# EAGLE design R107B (EAGLE 6.6.0)
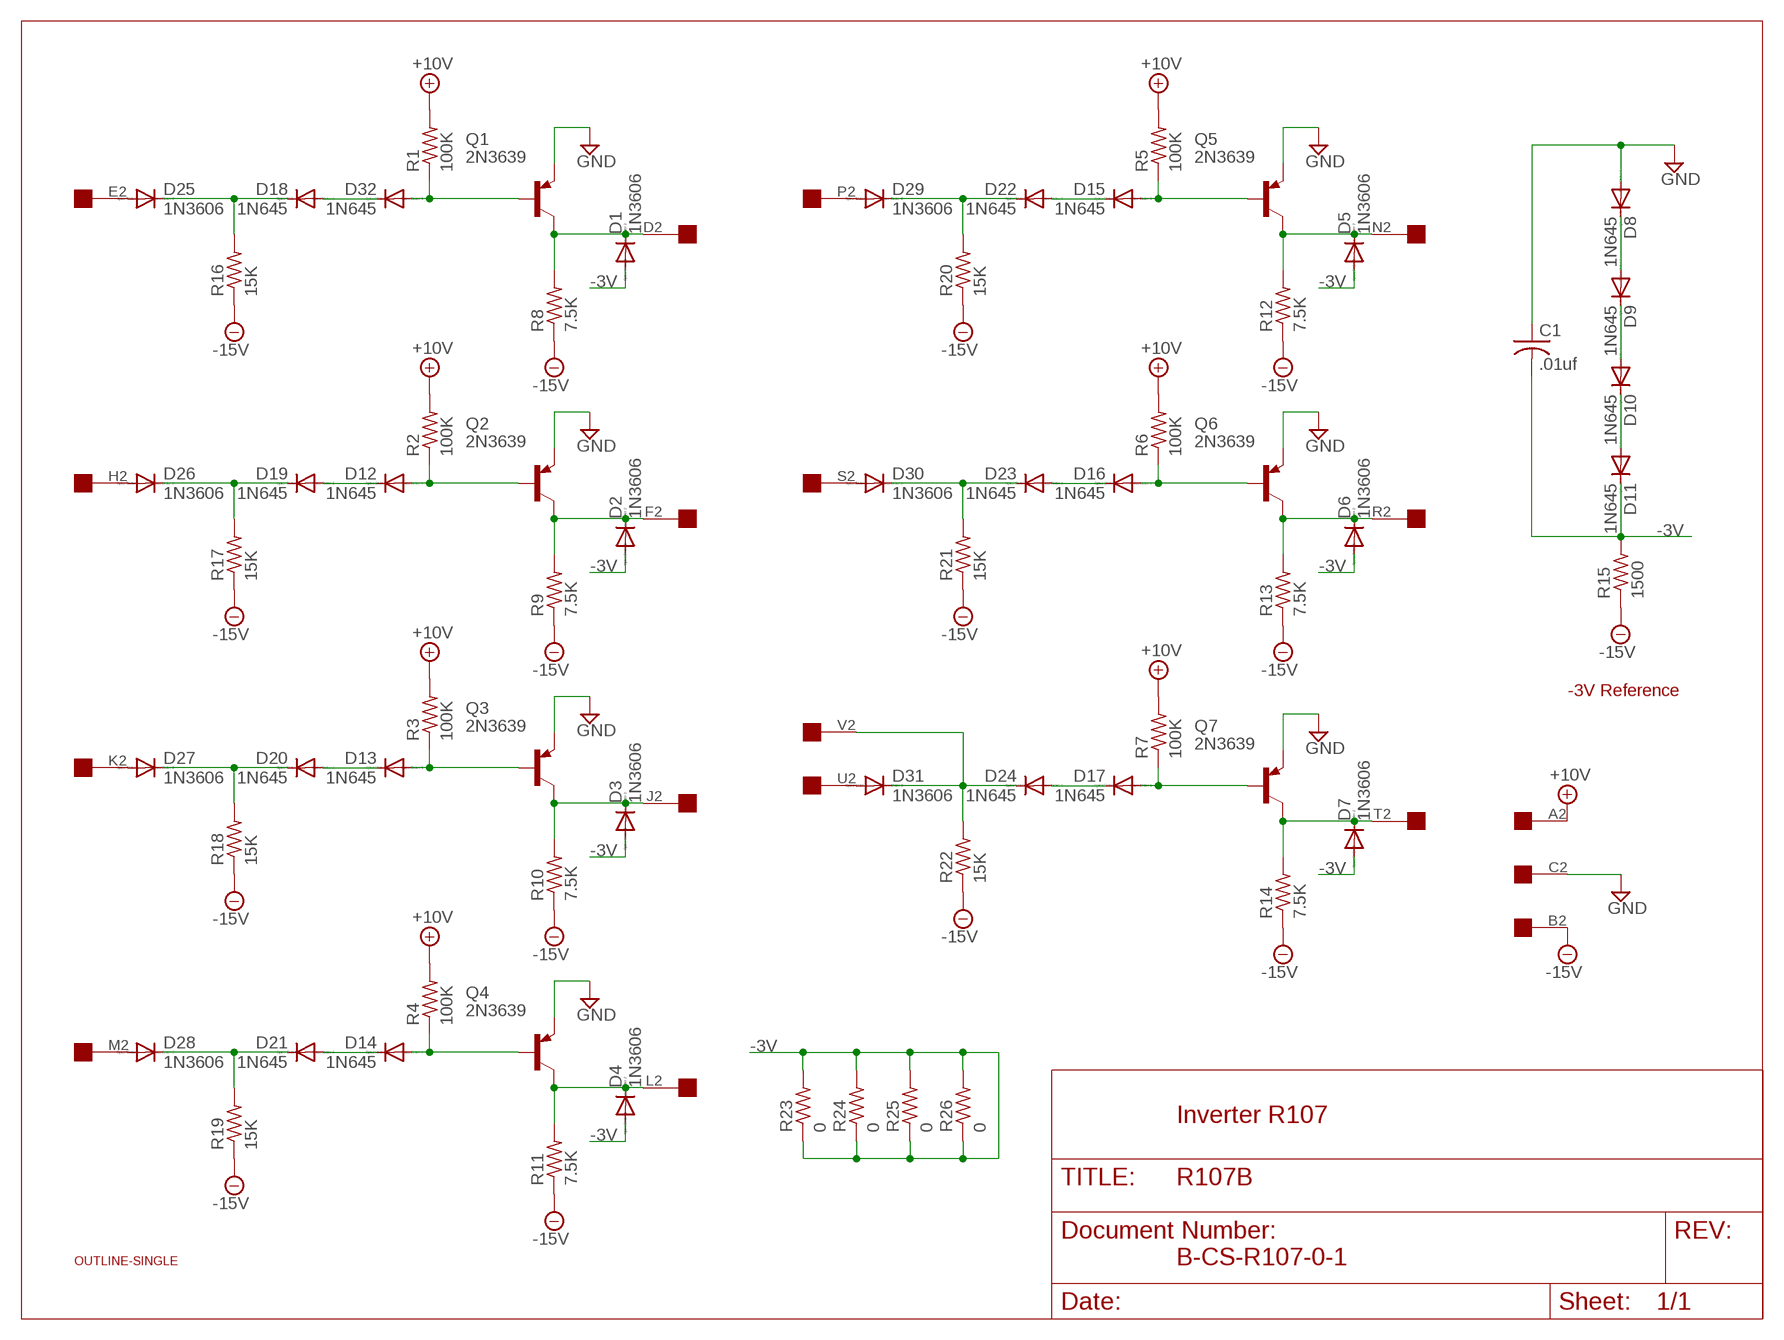
[diagram p0: schematic, sheet 1]

## Parts
C1  .01uf  C-US  [C063-025X075]
D1  1N3606  1N4148DO35-10  [DO35-10]
D2  1N3606  1N4148DO35-10  [DO35-10]
D3  1N3606  1N4148DO35-10  [DO35-10]
D4  1N3606  1N4148DO35-10  [DO35-10]
D5  1N3606  1N4148DO35-10  [DO35-10]
D6  1N3606  1N4148DO35-10  [DO35-10]
D7  1N3606  1N4148DO35-10  [DO35-10]
D8  1N645  1N4148DO35-10  [DO35-10]
D9  1N645  1N4148DO35-10  [DO35-10]
D10  1N645  1N4148DO35-10  [DO35-10]
D11  1N645  1N4148DO35-10  [DO35-10]
D12  1N645  1N4148DO35-10  [DO35-10]
D13  1N645  1N4148DO35-10  [DO35-10]
D14  1N645  1N4148DO35-10  [DO35-10]
D15  1N645  1N4148DO35-10  [DO35-10]
D16  1N645  1N4148DO35-10  [DO35-10]
D17  1N645  1N4148DO35-10  [DO35-10]
D18  1N645  1N4148DO35-10  [DO35-10]
D19  1N645  1N4148DO35-10  [DO35-10]
D20  1N645  1N4148DO35-10  [DO35-10]
D21  1N645  1N4148DO35-10  [DO35-10]
D22  1N645  1N4148DO35-10  [DO35-10]
D23  1N645  1N4148DO35-10  [DO35-10]
D24  1N645  1N4148DO35-10  [DO35-10]
D25  1N3606  1N4148DO35-10  [DO35-10]
D26  1N3606  1N4148DO35-10  [DO35-10]
D27  1N3606  1N4148DO35-10  [DO35-10]
D28  1N3606  1N4148DO35-10  [DO35-10]
D29  1N3606  1N4148DO35-10  [DO35-10]
D30  1N3606  1N4148DO35-10  [DO35-10]
D31  1N3606  1N4148DO35-10  [DO35-10]
D32  1N645  1N4148DO35-10  [DO35-10]
Q1  2N3639  2N3637  [TO39]
Q2  2N3639  2N3637  [TO39]
Q3  2N3639  2N3637  [TO39]
Q4  2N3639  2N3637  [TO39]
Q5  2N3639  2N3637  [TO39]
Q6  2N3639  2N3637  [TO39]
Q7  2N3639  2N3637  [TO39]
R1  100K  R-US_0207/10  [0207/10]
R2  100K  R-US_0207/10  [0207/10]
R3  100K  R-US_0207/10  [0207/10]
R4  100K  R-US_0207/10  [0207/10]
R5  100K  R-US_0207/10  [0207/10]
R6  100K  R-US_0207/10  [0207/10]
R7  100K  R-US_0207/10  [0207/10]
R8  7.5K  R-US_0207/10  [0207/10]
R9  7.5K  R-US_0207/10  [0207/10]
R10  7.5K  R-US_0207/10  [0207/10]
R11  7.5K  R-US_0207/10  [0207/10]
R12  7.5K  R-US_0207/10  [0207/10]
R13  7.5K  R-US_0207/10  [0207/10]
R14  7.5K  R-US_0207/10  [0207/10]
R15  1500  R-US_0207/10  [0207/10]
R16  15K  R-US_0207/10  [0207/10]
R17  15K  R-US_0207/10  [0207/10]
R18  15K  R-US_0207/10  [0207/10]
R19  15K  R-US_0207/10  [0207/10]
R20  15K  R-US_0207/10  [0207/10]
R21  15K  R-US_0207/10  [0207/10]
R22  15K  R-US_0207/10  [0207/10]
R23  0  R-US_0207/10  [0207/10]
R24  0  R-US_0207/10  [0207/10]
R25  0  R-US_0207/10  [0207/10]
R26  0  R-US_0207/10  [0207/10]
U$1  OUTLINE-SINGLE  [SINGLE]
U$2  EDGE-1  [EDGE-CON1]

## Nets
+10V [Power]: R1.2 R2.2 R3.2 R4.2 R5.2 R6.2 R7.2 U$2.A2
-3V [Power]: C1.2 D1.A D2.A D3.A D4.A D5.A D6.A D7.A D11.C R15.2 R23.1 R23.2 R24.1 R24.2 R25.1 R25.2 R26.1 R26.2
-15V [Power]: R8.1 R9.1 R10.1 R11.1 R12.1 R13.1 R14.1 R15.1 R16.1 R17.1 R18.1 R19.1 R20.1 R21.1 R22.1 U$2.B2
GND [Power]: C1.1 D8.A Q1.1(E) Q2.1(E) Q3.1(E) Q4.1(E) Q5.1(E) Q6.1(E) Q7.1(E) U$2.C2
N$1: D7.C Q7.3(C) R14.2 U$2.T2
N$2: D12.A Q2.2(B) R2.1
N$3: D8.C D9.A
N$4: D2.C Q2.3(C) R9.2 U$2.F2
N$5: D26.A U$2.H2
N$6: D19.C D26.C R17.2
N$7: D12.C D19.A
N$8: D13.A Q3.2(B) R3.1
N$9: D3.C Q3.3(C) R10.2 U$2.J2
N$10: D27.A U$2.K2
N$11: D20.C D27.C R18.2
N$12: D13.C D20.A
N$13: D9.C D10.A
N$14: D31.A U$2.U2
N$15: D17.A Q7.2(B) R7.1
N$16: D10.C D11.A
N$17: D24.C D31.C R22.2 U$2.V2
N$18: D17.C D24.A
N$19: D32.A Q1.2(B) R1.1
N$20: D1.C Q1.3(C) R8.2 U$2.D2
N$21: D25.A U$2.E2
N$22: D18.C D25.C R16.2
N$23: D18.A D32.C
N$24: D14.A Q4.2(B) R4.1
N$25: D4.C Q4.3(C) R11.2 U$2.L2
N$26: D28.A U$2.M2
N$27: D21.C D28.C R19.2
N$28: D14.C D21.A
N$29: D15.A Q5.2(B) R5.1
N$30: D5.C Q5.3(C) R12.2 U$2.N2
N$31: D29.A U$2.P2
N$32: D22.C D29.C R20.2
N$33: D15.C D22.A
N$34: D16.A Q6.2(B) R6.1
N$35: D6.C Q6.3(C) R13.2 U$2.R2
N$36: D30.A U$2.S2
N$37: D23.C D30.C R21.2
N$38: D16.C D23.A

## Notes on the sheet
- -3V Reference
- Inverter R107
- B-CS-R107-0-1

## Library data of the parts
C1 = dec-con:C-US: Capacitors with funky DEC lead spacing.
D1-D32 = diode:1N4148: DIODE high speed (Philips)
Q1-Q7 = transistor-pnp:2N3637*: PNP Transistror
R1-R26 = rcl:R-US_: RESISTOR, American symbol
U$1 = dec-con:OUTLINE-*: Board outlines for DEC boards.
U$2 = dec-con:EDGE-1: Single-Sided DEC Edge Connector -- (side 2)

## Net classes
0 default: width 0.813 mm
1 Power: width 0.813 mm

## Board
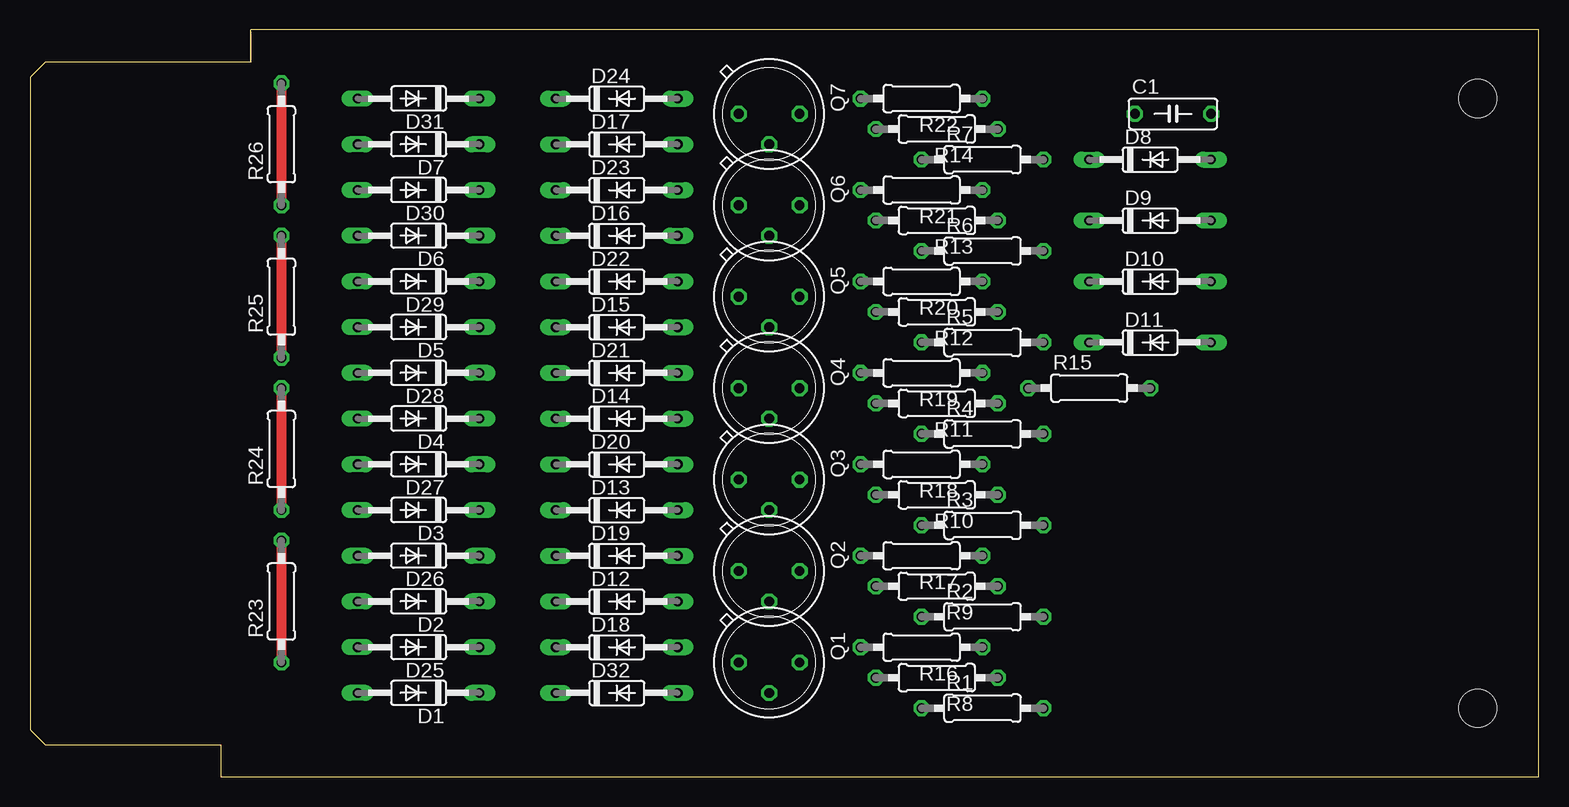
[diagram p1: board, top side]
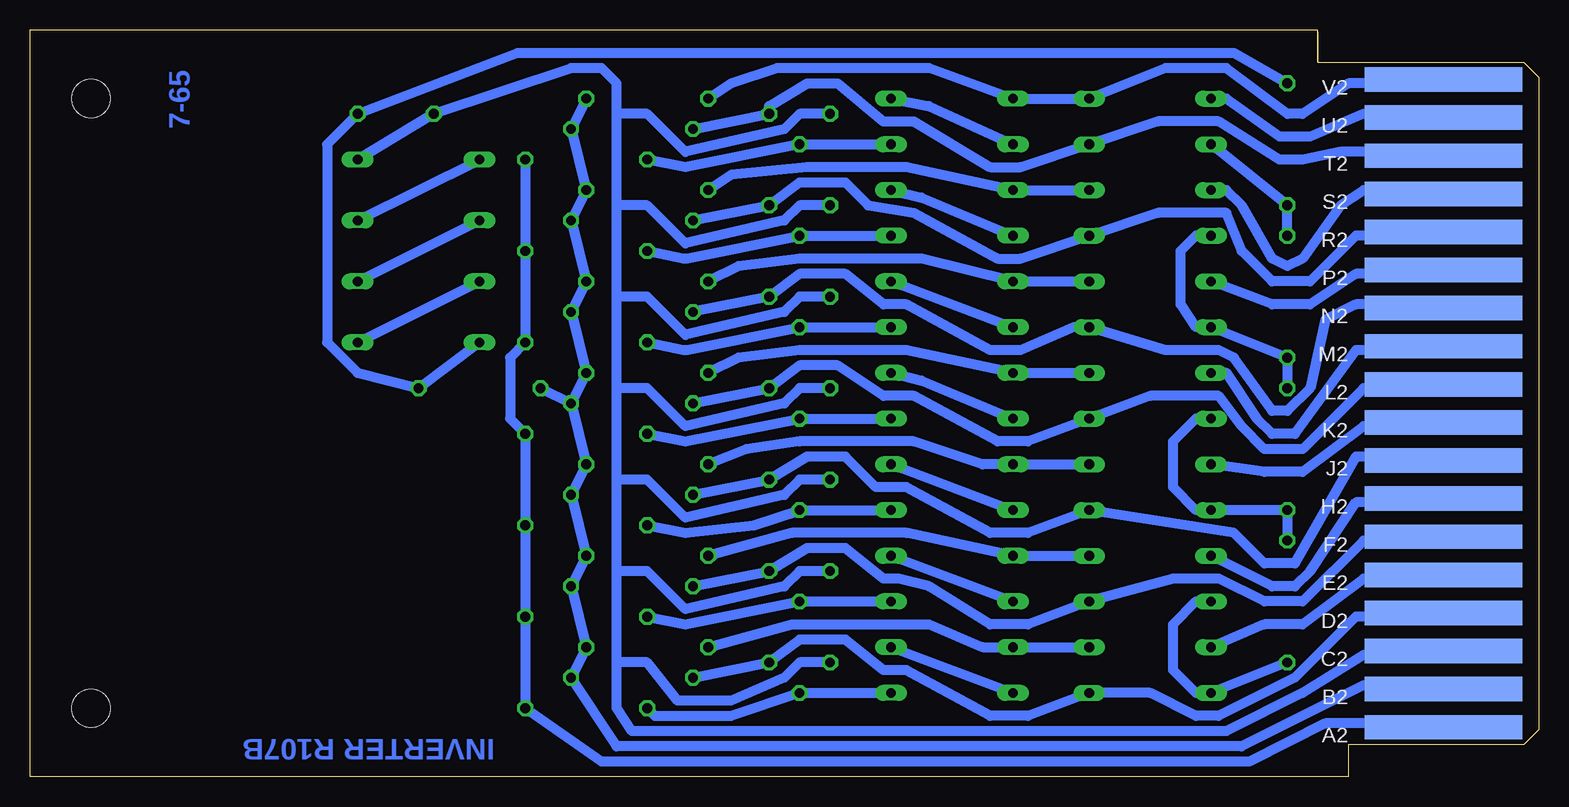
[diagram p2: board, bottom side, seen from below]

Size 125.73 x 62.23 mm. Coordinates in mm from the lower left corner, seen from the top.
Copper layers (1+16): Top 0.035mm / dielectric 1.5mm / Bottom 0.035mm
Design rules "16mils": minimum track width 16mil, minimum drill 32mil, track to track 15mil, track to pad 10mil, pad to pad 10mil, via to via 10mil, smd to smd 10mil, copper to edge 13mil, drill to drill 10mil, minimum pad ring 10mil, minimum via ring 8mil, stop-mask expansion 0mil, vias tented up to drill 0mil, thermal gap 10mil

### Footprints (pad centres in the part's own frame; a part is rotated, then mirrored left to right if it is on the bottom)
C063-025X075 = drill 0.813 octagon: 1 -2.54,0; 2 3.81,0
DO35-10 = drill 0.813 long: A 5.08,0; C -5.08,0
TO39 = drill 0.813 octagon: 1 0,-2.54; 2 2.54,0; 3 0,2.54
0207/10 = drill 0.813 octagon: 1 -5.08,0; 2 5.08,0
SINGLE = hole 3.175: 120.65,56.515; 120.65,5.715
EDGE-CON1 = smd 13.106 x 2.032 bottom: A2 7.938,4.128; B2 7.938,7.303; C2 7.938,10.477; D2 7.938,13.652; E2 7.938,16.828; F2 7.938,20.003; H2 7.938,23.177; J2 7.938,26.352; K2 7.938,29.527; L2 7.938,32.703; M2 7.938,35.877; N2 7.938,39.053; P2 7.938,42.227; R2 7.938,45.403; S2 7.938,48.578; T2 7.938,51.752; U2 7.938,54.928; V2 7.938,58.102

### Placement (x,y rotation side)
C1  94.62,55.24 0 top
D1  32.39,6.99 180 top
D2  32.39,14.61 180 top
D3  32.39,22.23 180 top
D4  32.39,29.84 180 top
D5  32.39,37.47 180 top
D6  32.39,45.09 180 top
D7  32.39,52.7 180 top
D8  93.35,51.44 0 top
D9  93.35,46.35 0 top
D10  93.35,41.27 0 top
D11  93.35,36.2 0 top
D12  48.9,14.61 0 top
D13  48.9,22.23 0 top
D14  48.9,29.84 0 top
D15  48.9,37.47 0 top
D16  48.9,45.09 0 top
D17  48.9,52.7 0 top
D18  48.9,10.79 0 top
D19  48.9,18.41 0 top
D20  48.9,26.04 0 top
D21  48.9,33.66 0 top
D22  48.9,41.27 0 top
D23  48.9,48.9 0 top
D24  48.9,56.52 0 top
D25  32.39,10.79 180 top
D26  32.39,18.41 180 top
D27  32.39,26.04 180 top
D28  32.39,33.66 180 top
D29  32.39,41.27 180 top
D30  32.39,48.9 180 top
D31  32.39,56.52 180 top
D32  48.9,6.99 0 top
Q1  61.6,9.53 270 top
Q2  61.6,17.14 270 top
Q3  61.6,24.77 270 top
Q4  61.6,32.38 270 top
Q5  61.6,40.01 270 top
Q6  61.6,47.62 270 top
Q7  61.6,55.24 270 top
R1  79.38,5.71 0 top
R2  79.38,13.34 0 top
R3  79.38,20.95 0 top
R4  79.38,28.57 0 top
R5  79.38,36.2 0 top
R6  79.38,43.81 0 top
R7  79.38,51.44 0 top
R8  75.57,8.26 180 top
R9  75.57,15.88 180 top
R10  75.57,23.5 180 top
R11  75.57,31.11 180 top
R12  75.57,38.73 180 top
R13  75.57,46.35 180 top
R14  75.57,53.98 180 top
R15  88.27,32.38 0 top
R16  74.3,10.79 180 top
R17  74.3,18.41 180 top
R18  74.3,26.04 180 top
R19  74.3,33.66 180 top
R20  74.3,41.27 180 top
R21  74.3,48.9 180 top
R22  74.3,56.52 180 top
R23  20.96,14.61 90 top
R24  20.96,27.3 90 top
R25  20.96,40.01 90 top
R26  20.96,52.7 90 top
U$1  0,0 0 top
U$2  0,0 0 top

### Tracks (layer width: path | path; a pad name or v marks a point on that pad's centre or on a via)
+10V
  Bottom 0.813: R7.2 R6.2 R5.2 85.73,34.92 85.73,29.84 R4.2 R3.2 R2.2 R1.2 78.11,1.27 24.13,1.27 17.78,4.45 13.34,4.45 U$2.A2
-3V
  Top 0.813: R26.2 R26.1 | R25.2 R25.1 | R24.2 R24.1 | R23.2 R23.1
  Bottom 0.813: R24.2 R25.1 D5.A 28.58,37.47 29.85,39.37 29.85,43.81 28.58,45.09 D6.A | R23.2 R24.1 D3.A 28.58,22.23 30.48,24.13 30.48,27.94 28.58,29.84 D4.A | R26.2 25.4,60.33 85.09,60.33 C1.2 100.97,52.7 100.97,36.2 98.43,33.66 R15.2 D11.C | R25.2 R26.1 D7.A | R23.1 D1.A 28.58,6.99 30.48,8.89 30.48,12.7 28.58,14.61 D2.A
-15V
  Bottom 0.813: R11.1 R19.1 R12.1 R20.1 R13.1 R21.1 R14.1 R22.1 | R15.1 R11.1 | U$2.B2 9.53,7.62 14.61,7.62 24.77,2.54 76.84,2.54 R8.1 R16.1 R9.1 R17.1 R10.1 R18.1 R11.1
GND
  Bottom 0.813: D8.A C1.1 80.65,59.05 78.11,59.05 76.84,57.78 76.84,55.24 | U$2.C2 9.53,10.16 14.61,10.16 19.69,6.99 26.04,3.81 75.57,3.81 76.84,5.71 76.84,9.53 | 76.84,9.53 76.84,17.14 | 76.84,17.14 76.84,24.77 | 76.84,24.77 76.84,32.38 | 76.84,32.38 76.84,40.01 | 76.84,40.01 76.84,47.62 | 76.84,47.62 76.84,55.24 | Q1.1 61.6,9.53 62.87,8.26 67.31,6.35 71.76,6.35 74.3,9.53 76.84,9.53 | Q7.1 61.6,55.24 62.87,53.98 71.12,52.07 74.3,55.24 76.84,55.24 | Q6.1 61.6,47.62 62.87,46.35 71.12,44.45 74.3,47.62 76.84,47.62 | Q5.1 61.6,40.01 62.87,38.73 71.12,36.83 74.3,40.01 76.84,40.01 | Q2.1 61.6,17.14 62.87,15.88 71.12,13.97 74.3,17.14 76.84,17.14 | Q3.1 61.6,24.77 62.87,23.5 71.12,21.59 74.3,24.77 76.84,24.77 | Q4.1 61.6,32.38 62.87,31.11 71.12,29.21 74.3,32.38 76.84,32.38
N$1
  Bottom 0.813: R14.2 Q7.3 64.14,55.88 60.96,57.78 58.42,57.78 54.61,54.61 52.07,54.61 45.72,50.8 43.18,50.8 D7.C 31.75,54.61 26.67,54.61 21.59,51.44 19.69,51.44 16.51,52.07 8.89,52.07 U$2.T2
N$2
  Bottom 0.813: D12.A Q2.2 71.12,12.7 R2.1
N$3
  Bottom 0.813: D9.A D8.C
N$4
  Bottom 0.813: R9.2 Q2.3 60.96,19.05 57.79,19.05 54.61,16.51 53.34,16.51 50.8,15.88 45.72,12.7 42.55,12.7 D2.C 30.48,16.51 26.67,16.51 22.86,14.61 19.69,14.61 14.61,19.68 8.26,19.68 U$2.F2
N$5
  Bottom 0.813: U$2.H2 8.89,22.86 15.24,22.86 19.05,17.14 20.32,15.88 22.23,15.88 D26.A
N$6
  Bottom 0.813: D26.C D19.C 52.71,20.32 62.23,20.32 R17.2
N$7
  Bottom 0.813: D19.A D12.C
N$8
  Bottom 0.813: R3.1 71.12,20.32 65.41,20.95 Q3.2 D13.A
N$9
  Bottom 0.813: R10.2 Q3.3 60.96,26.67 57.79,26.67 55.25,24.13 52.71,24.13 45.72,20.32 42.55,20.32 D3.C 25.4,20.32 22.86,17.78 20.32,17.78 15.24,26.67 8.89,26.67 U$2.J2
N$10
  Bottom 0.813: U$2.K2 8.89,29.21 14.61,29.21 19.69,25.4 22.86,25.4 D27.A
N$11
  Bottom 0.813: D27.C D20.C 46.36,26.04 52.07,27.94 61.6,27.94 66.04,27.3 R18.2
N$12
  Bottom 0.813: D20.A D13.C
N$13
  Bottom 0.813: D10.A D9.C
N$14
  Bottom 0.813: U$2.U2 8.89,55.24 14.61,55.24 19.05,53.34 21.59,53.34 26.04,56.52 D31.A
N$15
  Bottom 0.813: D17.A Q7.2 71.12,50.8 R7.1
N$16
  Bottom 0.813: D11.A D10.C
N$17
  Bottom 0.813: U$2.V2 8.26,57.78 15.88,57.78 19.69,55.24 20.96,55.24 26.04,59.05 31.12,59.05 D31.C D24.C 50.8,59.05 63.5,59.05 67.31,57.78 R22.2
N$18
  Bottom 0.813: D24.A 50.8,55.88 D17.C
N$19
  Bottom 0.813: R1.1 73.66,5.08 67.31,5.08 Q1.2 D32.A
N$20
  Bottom 0.813: R8.2 Q1.3 61.6,11.43 57.79,11.43 54.61,8.89 52.71,8.89 45.72,5.08 42.55,5.08 D1.C 32.39,6.99 28.58,5.08 26.67,5.08 20.32,8.26 15.24,13.34 8.89,13.34 U$2.D2
N$21
  Bottom 0.813: U$2.E2 8.89,16.51 14.61,16.51 19.69,12.7 22.86,12.7 D25.A
N$22
  Bottom 0.813: D25.C D18.C 46.36,10.79 50.8,12.7 62.23,12.7 R16.2
N$23
  Bottom 0.813: D18.A D32.C
N$24
  Bottom 0.813: R4.1 71.12,27.94 Q4.2 D14.A
N$25
  Bottom 0.813: R11.2 Q4.3 61.6,34.29 58.42,34.29 54.61,31.75 52.07,31.75 45.09,27.94 42.55,27.94 D4.C 32.39,31.75 26.67,31.75 24.77,29.21 22.86,27.3 19.69,27.3 14.61,32.38 8.89,32.38 U$2.L2
N$26
  Bottom 0.813: U$2.M2 8.89,35.56 15.24,35.56 20.32,28.57 22.23,28.57 23.5,29.84 26.04,33.66 D28.A
N$27
  Bottom 0.813: D28.C D21.C 52.71,35.56 61.6,35.56 66.68,34.92 R19.2
N$28
  Bottom 0.813: D21.A 51.44,33.02 D14.C
N$29
  Bottom 0.813: R5.1 71.12,35.56 Q5.2 D15.A
N$30
  Bottom 0.813: R12.2 Q5.3 61.6,41.91 57.79,41.91 54.61,39.37 52.71,39.37 45.72,35.56 43.18,35.56 38.74,37.47 D5.C 31.12,35.56 26.67,35.56 25.4,34.92 22.23,30.48 20.96,30.48 19.05,32.38 17.78,38.1 15.24,39.37 8.89,39.37 U$2.N2
N$31
  Bottom 0.813: U$2.P2 8.26,41.91 15.24,41.91 19.05,39.37 22.23,39.37 D29.A
N$32
  Bottom 0.813: D29.C D22.C 51.44,43.18 61.6,43.18 66.68,42.55 R20.2
N$33
  Bottom 0.813: D22.A D15.C
N$34
  Bottom 0.813: R6.1 71.12,43.18 Q6.2 D16.A
N$35
  Bottom 0.813: R13.2 Q6.3 61.6,49.53 57.79,49.53 55.88,47.62 52.07,46.99 45.09,43.18 43.18,43.18 D6.C 31.75,46.99 26.04,46.99 24.77,43.81 22.23,41.27 19.05,41.27 15.24,45.09 8.89,45.09 U$2.R2
N$36
  Bottom 0.813: U$2.S2 8.89,48.9 14.61,48.9 16.51,47.62 19.69,43.18 20.96,42.55 22.23,43.18 24.77,47.62 26.04,48.9 D30.A
N$37
  Bottom 0.813: D30.C D23.C 52.71,50.8 60.96,50.8 67.31,50.16 R21.2
N$38
  Bottom 0.813: D23.A 51.44,48.26 D16.C

### Text on the board
Bottom: 7-65 | INVERTER R107B